# EAGLE schematic p128necodrive (EAGLE 9.6.2)
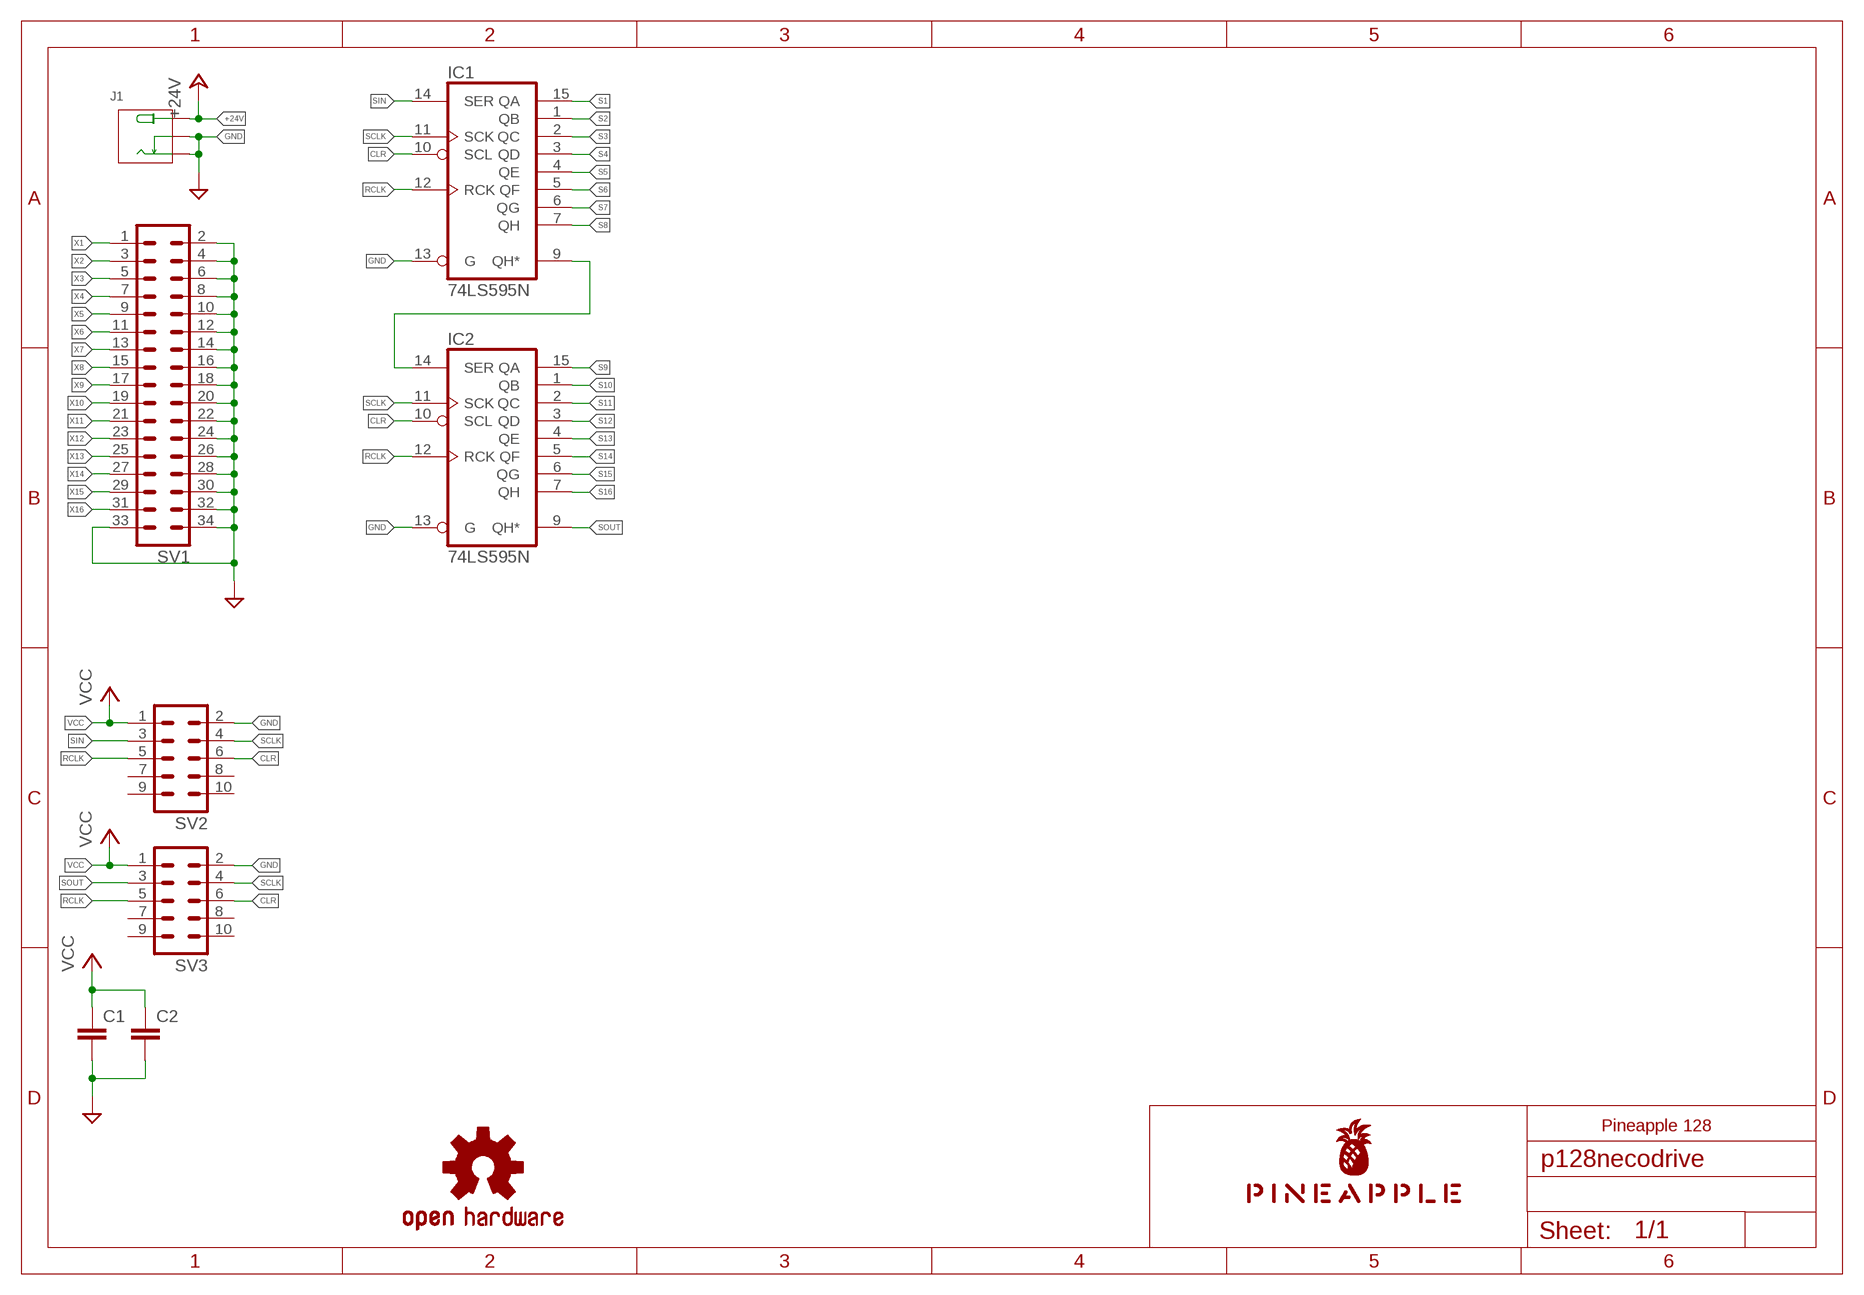
[diagram p0: schematic, sheet 1]

## Parts
C1  C-EU025-024X044  [C025-024X044]
C2  C-EU025-024X044  [C025-024X044]
IC1  74LS595N  [DIL16]
IC2  74LS595N  [DIL16]
J1  JACK-DC-005'DC-005'  [3P-L14.2*W11.0*H9.0MM]
LOGO1  OSHW-LOGOS-COPPER  [OSHW-LOGO-S_COPPER]
SV1  ML34L  [ML34L]
SV2  ML10L  [ML10L]
SV3  ML10L  [ML10L]
U$1  PINEAPPLE450_SILK  [PINEAPPLE450_SILK]

## Nets
+24V [power]: J1.+
CLR: IC1.10(SCL) IC2.10(SCL) SV2.6 SV3.6
GND [gnd]: C1.2 C2.2 IC1.13(G) IC2.13(G) J1.-1(-) J1.-2(CDN) SV1.2 SV1.4 SV1.6 SV1.8 SV1.10 SV1.12 SV1.14 SV1.16 SV1.18 SV1.20 SV1.22 SV1.24 SV1.26 SV1.28 SV1.30 SV1.32 SV1.33 SV1.34 SV2.2 SV3.2
N$9: IC1.9(QH*) IC2.14(SER)
RCLK: IC1.12(RCK) IC2.12(RCK) SV2.5 SV3.5
S1: IC1.15(QA)
S2: IC1.1(QB)
S3: IC1.2(QC)
S4: IC1.3(QD)
S5: IC1.4(QE)
S6: IC1.5(QF)
S7: IC1.6(QG)
S8: IC1.7(QH)
S9: IC2.15(QA)
S10: IC2.1(QB)
S11: IC2.2(QC)
S12: IC2.3(QD)
S13: IC2.4(QE)
S14: IC2.5(QF)
S15: IC2.6(QG)
S16: IC2.7(QH)
SCLK: IC1.11(SCK) IC2.11(SCK) SV2.4 SV3.4
SIN: IC1.14(SER) SV2.3
SOUT: IC2.9(QH*) SV3.3
VCC: C1.1 C2.1 SV2.1 SV3.1
X1 [power]: SV1.1
X2 [power]: SV1.3
X3 [power]: SV1.5
X4 [power]: SV1.7
X5 [power]: SV1.9
X6 [power]: SV1.11
X7 [power]: SV1.13
X8 [power]: SV1.15
X9 [power]: SV1.17
X10 [power]: SV1.19
X11 [power]: SV1.21
X12 [power]: SV1.23
X13 [power]: SV1.25
X14 [power]: SV1.27
X15 [power]: SV1.29
X16 [power]: SV1.31
Unconnected: SV2.7 SV2.8 SV2.9 SV2.10 SV3.7 SV3.8 SV3.9 SV3.10

## Notes on the sheet
- Pineapple 128

## Power pins joined to a net without a drawn wire
GND: IC1.8(GND) IC2.8(GND)
VCC: IC1.16(VCC) IC2.16(VCC)

## Library data of the parts
C1 C2 = resistor:C-EU: CAPACITOR, European symbol
IC1 IC2 = 74xx-us:74*595: 8-bit SHIFT REGISTER, output latch
J1 = Seeed-Connector:JACK-DC-005: 320120003
LOGO1 = SparkFun-Aesthetics:OSHW-LOGO: Open-Source Hardware (OSHW) Logo This logo indicates the piece of hardware it is found on incorporates a OSHW license and/or adheres to the definition of open source hardware found here: http://freedomdefined.org/OSHW
SV1 = con-ml:ML34L: HARTING; OC_FARNELL: unknown; OC_NEWARK: unknown
SV2 SV3 = con-ml:ML10L: HARTING; OC_FARNELL: unknown; OC_NEWARK: unknown
U$1 = pineapple:PINEAPPLE450_SILK

## Net classes
0 default: width 0.152 mm, drill 0.152 mm, clearance 0.152 mm
1 gnd: width 0.61 mm, drill 0.152 mm, clearance 0.152 mm
2 power: width 0.61 mm, drill 0.152 mm, clearance 0.152 mm
3 analog: width 0.305 mm, drill 0.152 mm, clearance 0.152 mm